# Altium schematic sheet Sheet1.SchDoc
size A4; SheetNumber: 1; SheetTotal: 1
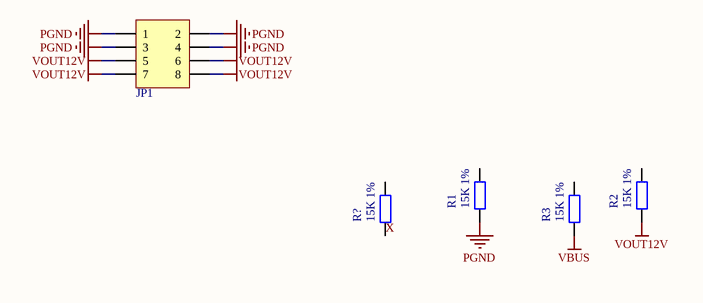
[diagram p0: Sheet1.SchDoc]

## Parts
JP1  Header 4X2  [4.2mm 8Pin 公头 插件]  (value not drawn)
R1  15K 1%  [内嵌载流铜条 2x2x66.5mm]
R2  15K 1%  [内嵌载流铜条 2x2x66.5mm]
R3  15K 1%  [内嵌载流铜条 2x2x66.5mm]
R?  15K 1%  [内嵌载流铜条 2x2x66.5mm]

## Nets
PGND: JP1.1 JP1.2 JP1.3 JP1.4 R1.2
VBUS: R3.2
VOUT12V: JP1.5 JP1.6 JP1.7 JP1.8 R2.2
X: R?.2

Not connected (* = marked no-connect by the designer): R1 1; R2 1; R3 1; R? 1

## Library data of the parts
JP1 = Header 4X2: 4*2P接插件; 版权归属: 源创客; BOM名称: 4*2P接插件; 学习资源: www.ooocke.com
R1-R3 R? = R: 贴片电阻; 版权归属: 源创客; BOM名称: 贴片电阻; 学习资源: www.ooocke.com